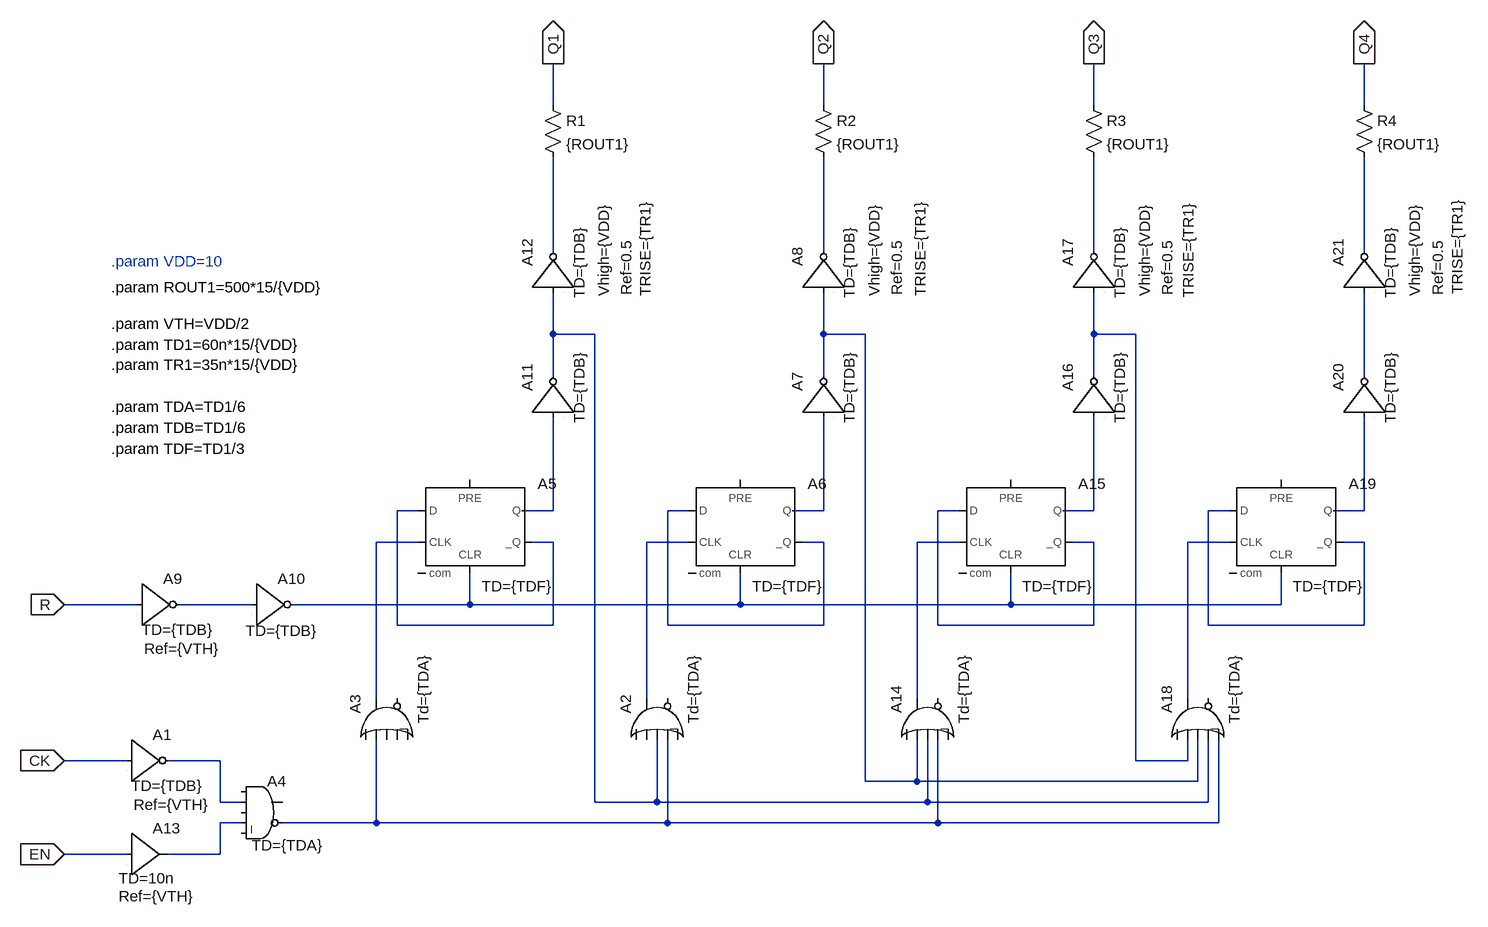
[diagram p0: schematic cd4520.asc]
cd4520.asc, the LTspice schematic file:
Version 4
SHEET 1 1920 680
WIRE 512 -688 512 -752
WIRE 928 -688 928 -752
WIRE 1344 -688 1344 -752
WIRE 1760 -688 1760 -752
WIRE 512 -464 512 -608
WIRE 928 -464 928 -608
WIRE 1344 -464 1344 -608
WIRE 1760 -464 1760 -608
WIRE 512 -336 512 -400
WIRE 576 -336 512 -336
WIRE 928 -336 928 -400
WIRE 992 -336 928 -336
WIRE 1344 -336 1344 -400
WIRE 1408 -336 1344 -336
WIRE 512 -272 512 -336
WIRE 928 -272 928 -336
WIRE 1344 -272 1344 -336
WIRE 1760 -272 1760 -400
WIRE 304 -64 272 -64
WIRE 512 -64 512 -208
WIRE 512 -64 464 -64
WIRE 720 -64 688 -64
WIRE 928 -64 928 -208
WIRE 928 -64 880 -64
WIRE 1136 -64 1104 -64
WIRE 1344 -64 1344 -208
WIRE 1344 -64 1296 -64
WIRE 1552 -64 1520 -64
WIRE 1760 -64 1760 -208
WIRE 1760 -64 1712 -64
WIRE 304 -16 240 -16
WIRE 512 -16 480 -16
WIRE 720 -16 656 -16
WIRE 928 -16 896 -16
WIRE 1136 -16 1072 -16
WIRE 1344 -16 1312 -16
WIRE 1552 -16 1488 -16
WIRE 1760 -16 1728 -16
WIRE -128 80 -240 80
WIRE 48 80 -64 80
WIRE 384 80 384 32
WIRE 384 80 112 80
WIRE 800 80 800 32
WIRE 800 80 384 80
WIRE 1216 80 1216 32
WIRE 1216 80 800 80
WIRE 1632 80 1632 32
WIRE 1632 80 1216 80
WIRE 272 112 272 -64
WIRE 512 112 512 -16
WIRE 512 112 272 112
WIRE 688 112 688 -64
WIRE 928 112 928 -16
WIRE 928 112 688 112
WIRE 1104 112 1104 -64
WIRE 1344 112 1344 -16
WIRE 1344 112 1104 112
WIRE 1520 112 1520 -64
WIRE 1760 112 1760 -16
WIRE 1760 112 1520 112
WIRE 240 224 240 -16
WIRE 656 224 656 -16
WIRE 1072 224 1072 -16
WIRE 1488 224 1488 -16
WIRE -144 320 -240 320
WIRE 0 320 -80 320
WIRE 1408 320 1408 -336
WIRE 1488 320 1488 288
WIRE 1488 320 1408 320
WIRE 992 352 992 -336
WIRE 1072 352 1072 288
WIRE 1072 352 992 352
WIRE 1504 352 1504 288
WIRE 1504 352 1072 352
WIRE 0 384 0 320
WIRE 32 384 0 384
WIRE 576 384 576 -336
WIRE 672 384 672 288
WIRE 672 384 576 384
WIRE 1088 384 1088 288
WIRE 1088 384 672 384
WIRE 1520 384 1520 288
WIRE 1520 384 1088 384
WIRE 32 416 0 416
WIRE 240 416 240 288
WIRE 240 416 96 416
WIRE 688 416 688 288
WIRE 688 416 240 416
WIRE 1104 416 1104 288
WIRE 1104 416 688 416
WIRE 1536 416 1536 288
WIRE 1536 416 1104 416
WIRE -144 464 -240 464
WIRE 0 464 0 416
WIRE 0 464 -80 464
FLAG -240 464 EN
IOPIN -240 464 In
FLAG -240 320 CK
IOPIN -240 320 In
FLAG -240 80 R
IOPIN -240 80 In
FLAG 512 -752 Q1
IOPIN 512 -752 Out
FLAG 928 -752 Q2
IOPIN 928 -752 Out
FLAG 1344 -752 Q3
IOPIN 1344 -752 Out
FLAG 1760 -752 Q4
IOPIN 1760 -752 Out
SYMBOL Digital\\inv -144 256 R0
WINDOW 3 7 103 Left 0
WINDOW 123 11 132 Left 0
SYMATTR Value TD={TDB}
SYMATTR Value2 Ref={VTH}
SYMATTR InstName A1
SYMBOL Digital\\or 192 256 R270
WINDOW 3 -8 120 Left 0
SYMATTR Value Td={TDA}
SYMATTR InstName A3
SYMBOL Digital\\and 64 336 R0
WINDOW 3 -16 114 Left 0
SYMATTR Value TD={TDA}
SYMATTR InstName A4
SYMBOL Digital\\dflop 384 -112 R0
WINDOW 3 18 164 Left 0
SYMATTR Value TD={TDF}
SYMATTR InstName A5
SYMBOL Digital\\inv 48 16 R0
WINDOW 3 -9 104 Left 0
SYMATTR Value TD={TDB}
SYMATTR InstName A10
SYMBOL Digital\\inv 448 -208 R270
WINDOW 3 -9 104 Left 0
SYMATTR Value TD={TDB}
SYMATTR InstName A11
SYMBOL Digital\\inv 448 -400 R270
WINDOW 3 -9 104 Left 0
WINDOW 123 -6 142 Left 0
WINDOW 39 -4 177 Left 0
WINDOW 40 -6 206 Left 0
SYMATTR Value TD={TDB}
SYMATTR Value2 Vhigh={VDD}
SYMATTR SpiceLine Ref=0.5
SYMATTR InstName A12
SYMATTR SpiceLine2 TRISE={TR1}
SYMBOL Digital\\buf1 -144 400 R0
WINDOW 3 -12 101 Left 0
WINDOW 123 -12 129 Left 0
SYMATTR Value TD=10n
SYMATTR Value2 Ref={VTH}
SYMATTR InstName A13
SYMBOL Digital\\inv -128 16 R0
WINDOW 3 7 103 Left 0
WINDOW 123 11 132 Left 0
SYMATTR Value TD={TDB}
SYMATTR Value2 Ref={VTH}
SYMATTR InstName A9
SYMBOL Digital\\or 608 256 R270
WINDOW 3 -8 120 Left 0
SYMATTR Value Td={TDA}
SYMATTR InstName A2
SYMBOL Digital\\dflop 800 -112 R0
WINDOW 3 18 164 Left 0
SYMATTR Value TD={TDF}
SYMATTR InstName A6
SYMBOL Digital\\inv 864 -208 R270
WINDOW 3 -9 104 Left 0
SYMATTR Value TD={TDB}
SYMATTR InstName A7
SYMBOL Digital\\inv 864 -400 R270
WINDOW 3 -9 104 Left 0
WINDOW 123 -6 142 Left 0
WINDOW 39 -4 177 Left 0
WINDOW 40 -6 213 Left 0
SYMATTR Value TD={TDB}
SYMATTR Value2 Vhigh={VDD}
SYMATTR SpiceLine Ref=0.5
SYMATTR InstName A8
SYMATTR SpiceLine2 TRISE={TR1}
SYMBOL Digital\\or 1024 256 R270
WINDOW 3 -8 120 Left 0
SYMATTR Value Td={TDA}
SYMATTR InstName A14
SYMBOL Digital\\dflop 1216 -112 R0
WINDOW 3 18 164 Left 0
SYMATTR Value TD={TDF}
SYMATTR InstName A15
SYMBOL Digital\\inv 1280 -208 R270
WINDOW 3 -9 104 Left 0
SYMATTR Value TD={TDB}
SYMATTR InstName A16
SYMBOL Digital\\inv 1280 -400 R270
WINDOW 3 -9 104 Left 0
WINDOW 123 -6 142 Left 0
WINDOW 39 -4 177 Left 0
WINDOW 40 -8 209 Left 0
SYMATTR Value TD={TDB}
SYMATTR Value2 Vhigh={VDD}
SYMATTR SpiceLine Ref=0.5
SYMATTR InstName A17
SYMATTR SpiceLine2 TRISE={TR1}
SYMBOL Digital\\or 1440 256 R270
WINDOW 3 -8 120 Left 0
SYMATTR Value Td={TDA}
SYMATTR InstName A18
SYMBOL Digital\\dflop 1632 -112 R0
WINDOW 3 18 164 Left 0
SYMATTR Value TD={TDF}
SYMATTR InstName A19
SYMBOL Digital\\inv 1696 -208 R270
WINDOW 3 -9 104 Left 0
SYMATTR Value TD={TDB}
SYMATTR InstName A20
SYMBOL Digital\\inv 1696 -400 R270
WINDOW 3 -9 104 Left 0
WINDOW 123 -6 142 Left 0
WINDOW 39 -4 177 Left 0
WINDOW 40 -3 207 Left 0
SYMATTR Value TD={TDB}
SYMATTR Value2 Vhigh={VDD}
SYMATTR SpiceLine Ref=0.5
SYMATTR InstName A21
SYMATTR SpiceLine2 TRISE={TR1}
SYMBOL res 496 -704 R0
SYMATTR InstName R1
SYMATTR Value {ROUT1}
SYMBOL res 912 -704 R0
SYMATTR InstName R2
SYMATTR Value {ROUT1}
SYMBOL res 1328 -704 R0
SYMATTR InstName R3
SYMATTR Value {ROUT1}
SYMBOL res 1744 -704 R0
SYMATTR InstName R4
SYMATTR Value {ROUT1}
TEXT -168 -320 Left 0 !.param TD1=60n*15/{VDD}\n.param TR1=35n*15/{VDD}
TEXT -168 -224 Left 0 !.param TDA=TD1/6
TEXT -168 -192 Left 0 !.param TDB=TD1/6
TEXT -168 -160 Left 0 !.param TDF=TD1/3
TEXT -168 -448 Left 0 ;.param VDD=10
TEXT -168 -352 Left 0 !.param VTH=VDD/2
TEXT -168 -408 Left 0 !.param ROUT1=500*15/{VDD}

The netlist it stands for:
* cd4520.asc
A1 CK 0 0 0 0 N023 0 0 BUF TD={TDB} Ref={VTH}
A3 0 N025 0 0 0 0 N017 0 OR Td={TDA}
A4 0 N023 0 N024 0 N025 0 0 AND TD={TDA}
A5 N009 0 N017 0 N022 N009 N010 0 DFLOP TD={TDF}
A10 N021 0 0 0 0 N022 0 0 BUF TD={TDB}
A11 N010 0 0 0 0 N005 0 0 BUF TD={TDB}
A12 N005 0 0 0 0 N001 0 0 BUF TD={TDB} Vhigh={VDD} Ref=0.5 TRISE={TR1}
A13 EN 0 0 0 0 0 N024 0 BUF TD=10n Ref={VTH}
A9 R 0 0 0 0 N021 0 0 BUF TD={TDB} Ref={VTH}
A2 0 0 N005 N025 0 0 N018 0 OR Td={TDA}
A6 N011 0 N018 0 N022 N011 N012 0 DFLOP TD={TDF}
A7 N012 0 0 0 0 N006 0 0 BUF TD={TDB}
A8 N006 0 0 0 0 N002 0 0 BUF TD={TDB} Vhigh={VDD} Ref=0.5 TRISE={TR1}
A14 0 N006 N005 N025 0 0 N019 0 OR Td={TDA}
A15 N013 0 N019 0 N022 N013 N014 0 DFLOP TD={TDF}
A16 N014 0 0 0 0 N007 0 0 BUF TD={TDB}
A17 N007 0 0 0 0 N003 0 0 BUF TD={TDB} Vhigh={VDD} Ref=0.5 TRISE={TR1}
A18 0 N007 N006 N005 N025 0 N020 0 OR Td={TDA}
A19 N015 0 N020 0 N022 N015 N016 0 DFLOP TD={TDF}
A20 N016 0 0 0 0 N008 0 0 BUF TD={TDB}
A21 N008 0 0 0 0 N004 0 0 BUF TD={TDB} Vhigh={VDD} Ref=0.5 TRISE={TR1}
R1 Q1 N001 {ROUT1}
R2 Q2 N002 {ROUT1}
R3 Q3 N003 {ROUT1}
R4 Q4 N004 {ROUT1}
.param TD1=60n*15/{VDD}
.param TR1=35n*15/{VDD}
.param TDA=TD1/6
.param TDB=TD1/6
.param TDF=TD1/3
* .param VDD=10
.param VTH=VDD/2
.param ROUT1=500*15/{VDD}
.backanno
.end